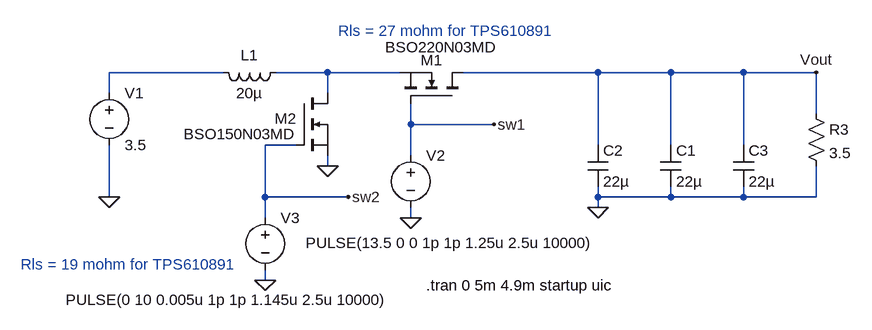
[diagram p0: schematic BoostConceptral.asc]
BoostConceptral.asc, the LTspice schematic file:
Version 4
SHEET 1 1276 680
WIRE -432 112 -608 112
WIRE -272 112 -352 112
WIRE -160 112 -272 112
WIRE 144 112 -64 112
WIRE 256 112 144 112
WIRE 368 112 256 112
WIRE 480 112 368 112
WIRE -608 144 -608 112
WIRE -272 144 -272 112
WIRE 480 176 480 112
WIRE -144 192 -144 160
WIRE -16 192 -144 192
WIRE -320 224 -368 224
WIRE 144 224 144 112
WIRE 256 224 256 112
WIRE 368 224 368 112
WIRE -144 240 -144 192
WIRE -272 256 -272 240
WIRE -608 304 -608 224
WIRE -368 304 -368 224
WIRE -240 304 -368 304
WIRE 144 304 144 288
WIRE 256 304 256 288
WIRE 256 304 144 304
WIRE 368 304 368 288
WIRE 368 304 256 304
WIRE 480 304 480 256
WIRE 480 304 368 304
WIRE 144 320 144 304
WIRE -368 336 -368 304
WIRE -144 336 -144 320
WIRE -368 432 -368 416
FLAG 144 320 0
FLAG -608 304 0
FLAG -144 336 0
FLAG -368 432 0
FLAG 480 112 Vout
FLAG -16 192 sw1
FLAG -240 304 sw2
FLAG -272 256 0
SYMBOL ind -336 96 R90
WINDOW 0 5 56 VBottom 2
WINDOW 3 32 56 VTop 2
SYMATTR InstName L1
SYMATTR Value 20µ
SYMATTR SpiceLine Ipk=5 Rser=0.02 Rpar=0 Cpar=0
SYMBOL res 464 160 R0
SYMATTR InstName R3
SYMATTR Value 3.5
SYMBOL voltage -608 128 R0
WINDOW 123 0 0 Left 2
WINDOW 39 0 0 Left 2
SYMATTR InstName V1
SYMATTR Value 3.5
SYMBOL nmos -320 144 R0
WINDOW 3 -173 63 Left 2
WINDOW 0 -33 39 Left 2
SYMATTR Value BSO150N03MD
SYMATTR InstName M2
SYMBOL voltage -144 224 R0
WINDOW 123 0 0 Left 2
WINDOW 39 0 0 Left 2
WINDOW 3 -162 151 Left 2
SYMATTR Value PULSE(13.5 0 0 1p 1p 1.25u 2.5u 10000)
SYMATTR InstName V2
SYMBOL voltage -368 320 R0
WINDOW 3 -307 142 Left 2
WINDOW 123 0 0 Left 2
WINDOW 39 0 0 Left 2
SYMATTR Value PULSE(0 10 0.005u 1p 1p 1.145u 2.5u 10000)
SYMATTR InstName V3
SYMBOL nmos -64 160 M270
WINDOW 0 67 31 VRight 2
WINDOW 3 87 119 VLeft 2
SYMATTR InstName M1
SYMATTR Value BSO220N03MD
SYMBOL cap 128 224 R0
SYMATTR InstName C2
SYMATTR Value 22µ
SYMATTR SpiceLine V=25 Irms=0 Rser=0 Lser=0 mfg="Murata" pn="GRM32ER71E226ME15" type="X7R"
SYMBOL cap 240 224 R0
SYMATTR InstName C1
SYMATTR Value 22µ
SYMATTR SpiceLine V=25 Irms=0 Rser=0 Lser=0 mfg="Murata" pn="GRM32ER71E226ME15" type="X7R"
SYMBOL cap 352 224 R0
SYMATTR InstName C3
SYMATTR Value 22µ
SYMATTR SpiceLine V=25 Irms=0 Rser=0 Lser=0 mfg="Murata" pn="GRM32ER71E226ME15" type="X7R"
TEXT -120 440 Left 2 !.tran 0 5m 4.9m startup uic
TEXT -256 48 Left 2 ;Rls = 27 mohm for TPS610891
TEXT -744 408 Left 2 ;Rls = 19 mohm for TPS610891

The netlist it stands for:
* BoostConceptral.asc
L1 N002 N001 20µ Ipk=5 Rser=0.02 Rpar=0 Cpar=0
R3 Vout 0 3.5
V1 N001 0 3.5
M2 N002 sw2 0 0 BSO150N03MD
V2 sw1 0 PULSE(13.5 0 0 1p 1p 1.25u 2.5u 10000)
V3 sw2 0 PULSE(0 10 0.005u 1p 1p 1.145u 2.5u 10000)
M1 Vout sw1 N002 N002 BSO220N03MD
C2 Vout 0 22µ V=25 Irms=0 Rser=0 Lser=0 mfg="Murata" pn="GRM32ER71E226ME15" type="X7R"
C1 Vout 0 22µ V=25 Irms=0 Rser=0 Lser=0 mfg="Murata" pn="GRM32ER71E226ME15" type="X7R"
C3 Vout 0 22µ V=25 Irms=0 Rser=0 Lser=0 mfg="Murata" pn="GRM32ER71E226ME15" type="X7R"
.model NMOS NMOS
.model PMOS PMOS
.lib standard.mos
.tran 0 5m 4.9m startup uic
* Rls = 27 mohm for TPS610891
* Rls = 19 mohm for TPS610891
.backanno
.end